# Altium schematic sheet Power.SchDoc
size A3; Author: Ali Zoubir; Organization: ETML-ES; Address1: Avenue Recordon 1; Address2: 1004 Lausanne; Address3: Switzerland; Revision: 1924B; SheetNumber: 4; SheetTotal: 4; Version: V0
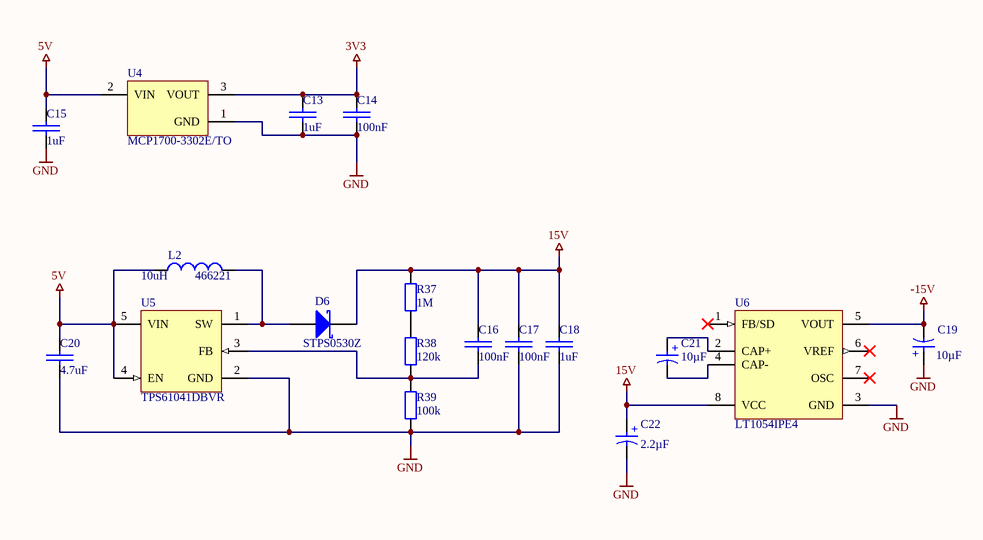
[diagram p0: Power.SchDoc]

## Parts
C13  1uF  [Cap_0805]
C14  100nF  [Cap_0805]
C15  1uF  [Cap_0805]
C16  100nF  [Cap_0805]
C17  100nF  [Cap_0805]
C18  1uF  [Cap_0805]
C19  Capacitance: 10µF  [WCAP-ASLI_D5H5.5]  (hidden comment: 865080642006)
C20  4.7uF  [Cap_0805]
C21  Capacitance: 10µF  [WCAP-ASLI_D5H5.5]  (hidden comment: 865080642006)
C22  Capacitance: 2.2µF  [WCAP-ASLL_D4H5.5]  (hidden comment: 865060640002)
D6  STPS0530Z  [SOD-123]
L2  10uH  Supplier Part Number 1: 466221  [SRN3015C]
R37  1M  [RES_0805]
R38  120k  [RES_0805]
R39  100k  [RES_0805]
U4  MCP1700-3302E/TO  [TO-92-TO3]
U5  TPS61041DBVR  [DBV0005A_M]
U6  LT1054IPE4  [TI-P8]

## Nets
3V3: C13.1 C14.1 U4.3(VOUT)
5V: C15.1 C20.1 L2.1 U4.2(VIN) U5.4(EN) U5.5(VIN)
15V: C16.1 C17.1 C18.1 C22.1(P) D6.K R37.1 U6.8(VCC)
-15V: C19.2(N) U6.5(VOUT)
GND: C13.2 C14.2 C15.2 C17.2 C18.2 C19.1(P) C20.2 C22.2(N) R39.2 U4.1(GND) U5.2(GND) U6.3(GND)
NetC16_2: C16.2 R38.2 R39.1 U5.3(FB)
NetC21_1: C21.1(P) U6.2(CAP+)
NetC21_2: C21.2(N) U6.4(CAP-)
NetD6_A: D6.A L2.2 U5.1(SW)
NetR37_2: R37.2 R38.1

Not connected (* = marked no-connect by the designer): U6 1(FB/SD)* 6(VREF)* 7(OSC)*

## Notes on the sheet
- Fichier :
- a
- Date :
- Heure :
- Version :
- Auteur :
- Modif.
- b
- c
- d
- Projet :
- No :
- Nb feuilles
- Feuille n°
- Chemin :
- (in symbol CMP-03913-53914525-3) +
- (in symbol CMP-03913-53914615-2) +

## Library data of the parts
C13-C18 C20 = C: SDTSourceLibName: C:\WINDOWS\TEMP\DA.LIB; PCB Footprint: RC0805
C19 C21 = CMP-03913-53914615-2: Alum. Electrolytic Cap 10UF 50V, 5MM Surface Mount, Lifetime 2000H, +105OC; Impedance: 2.8Ω; Tolerance: 20%; Ripple Current (AC): 95mA; Insulation Resistance: 10MΩ; Life (Hours): 2000hours; ESR (Equivalent Series Resistance): 1.63932Ω; Polarity: Polar; Leakage Current: 5µA; Case/Package: Radial; Max Operating Temperature: 105°C; Height: 5.5mm; Voltage Rating (DC): 50V; REACH SVHC: Unknown; Length: 5.5mm; Width: 5.3mm; Mount: Surface Mount; Min Operating Temperature: -55°C; Ripple Current: 95mA; Diameter: 5mm; RoHS: Compliant; Voltage Rating: 50V; Height - Seated (Max): 5.5118mm
C22 = CMP-03913-53914525-3: WCAP-ASLL Aluminum Electrolytic Capacitors; Life (Hours): 2000hours; Insulation Resistance: 16.6667MΩ; Ripple Current: 60mA; Impedance: 3.9Ω; Leakage Current: 3µA; Voltage Rating (DC): 50V; Polarity: Polar; Tolerance: 20%; Case/Package: Radial; Length: 5.5mm; Height - Seated (Max): 5.5118mm; Height: 5.5mm; Ripple Current (AC): 60mA; REACH SVHC: Unknown; RoHS: Compliant; Voltage Rating: 50V; Mount: Surface Mount; Min Operating Temperature: -55°C; Max Operating Temperature: 105°C; Diameter: 4mm
L2 = Inductor: Code_IEC: 1005; Published: 8-Jun-2000; LatestRevisionDate: 29-May-2009; LatestRevisionNote: IPC-7351 Footprint Added.; PackageReference: 0402-A; Publisher: Altium Limited; PackageDescription: Chip Inductor; Code_JEITA: 0402; Value: 10uH; Supplier 1: RS
R37-R39 = CMP-2001-00528-1: Res 0805; Part Number: ERJ6ENF2703V; Manufacturer: Panasonic
U4 = CMP-0136-00007-1: Low Quiescent Current LDO, 3-Pin TO-92, Extended TemperatureBAG; PackageReference: TO-92-TO3; PackageDescription: 3-Lead Plastic Transistor Outline (TO) [TO-92]; DatasheetVersion: revB, Feb-2007; PackageVersion: revBB, Aug-2009
U5 = CMP-0388-00116-2: 28 V, 250 mA Switch Boost Converter for LCD and White LED Applications, 1.8 to 6 V, -40 to 85 degC, 5-pin SOT23 (DBV5), Green (RoHS & no Sb/Br); Manufacturer: Texas Instruments; SubFamily: White LED Driver; Vin(Max)(V): 6; Rating: Catalog; Switching Frequency(Max)(kHz): 1000; Dimming: TRUE; Iq(Typ)(mA): 0.028; Vin(Min)(V): 1.8; Iout(Max)(A): 0.05; PackageVersion: 4073253-4/K; PackageDescription: 5-Pin Plastic Small Outline, Body 1.60 Ãƒâ€” 2.90 mm, Pitch 0.95 mm; Mounting Technology: Surface Mount; Topology: Boost; ComponentLink2Description: Datasheet; DatasheetVersion: SLVS413F; ComponentLink3URL: http://www.ti.com/litv/pdf/mpds018i; ComponentLink3Description: Package Specification; Code_JEDEC: MO-178; Eco-Plan: Green (RoHS & no Sb/Br); ComponentLink1URL: http://www.ti.com/; ComponentLink2URL: http://www.ti.com/general/docs/lit/getliterature.tsp?genericPartNumber=TPS61041&fileType=pdf; PackageReference: DBV0005A; PartNumber: TPS61041DBVR; ComponentLink1Description: Manufacturer URL
U6 = CMP-0391-00172-1: -5 V, Buck / Boost Charge Pump, 100 mA, 3.5 to 15 V Input, -40 to 85 degC, 8-pin DIP (P8), Pb-Free (RoHS); Manufacturer: Texas Instruments; Switching Frequency(Max)(kHz): 35; Vin(Min)(V): 3.5; Iout(Max)(A): 0.1; Vout(Min)(V): -4.7; Iq(Typ)(mA): 2.5; Vin(Max)(V): 15; Vout(Max)(V): -5.2; ComponentLink2URL: http://www.ti.com/general/docs/lit/getliterature.tsp?genericPartNumber=LT1054&fileType=pdf; Preset Vout(V): -5; PartNumber: LT1054IPE4; ComponentLink3URL: http://www.ti.com/litv/pdf/mpdi001b; Eco-Plan: Pb-Free (RoHS); PackageDescription: 8-Pin Plastic In-Line, Body 9.59 x 6.35 mm, 2.54 mm Pitch; Code_JEDEC: MS-001; PackageReference: P8; Mounting Technology: Through Hole; PackageVersion: 4040082/E; DatasheetVersion: SLVS033F; ComponentLink3Description: Package Specification; ComponentLink1URL: http://www.ti.com/; ComponentLink1Description: Manufacturer URL; Topology: Buck/Boost; ComponentLink2Description: Datasheet